# Altium schematic sheet PLD_Flash-Memory.SchDoc: Flash Memory
size A4; SheetTotal: 32
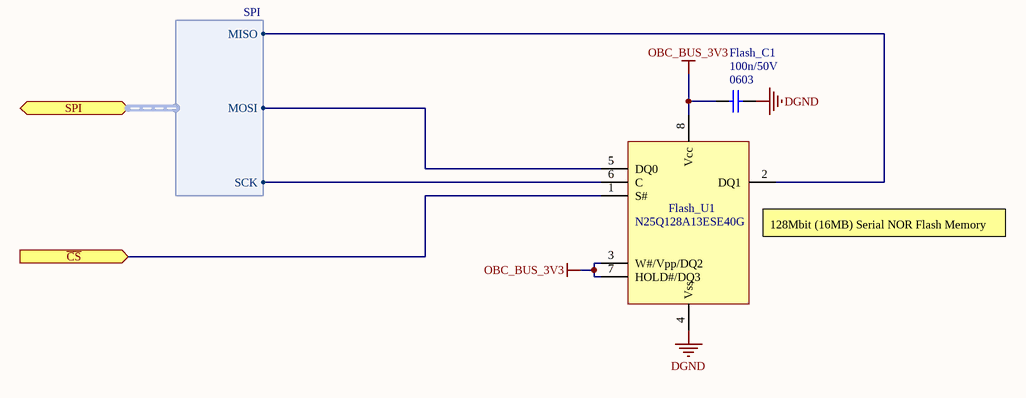
[diagram p0: PLD_Flash-Memory.SchDoc]

## Parts
Flash_C1  Package: 0603  [SMD_Capacitor_0603]  (hidden comment: 100n/50V)
Flash_U1  (no value)  [SOIC-8-W]

## Ports
SPI (harness SPI), ~{CS} (in)

## Harnesses
SPI: MISO, MOSI, SCK

## Nets
DGND: Flash_C1.1 Flash_U1.4(Vss)
OBC_BUS_3V3: Flash_C1.2 Flash_U1.3(W#/Vpp/DQ2) Flash_U1.7(HOLD#/DQ3) Flash_U1.8(Vcc)
~{CS}: Flash_U1.1(S#) ; port ~{CS}
NetFlash_U1_2: Flash_U1.2(DQ1) ; port SPI.MISO
NetFlash_U1_5: Flash_U1.5(DQ0) ; port SPI.MOSI
NetFlash_U1_6: Flash_U1.6(C) ; port SPI.SCK

## Notes on the sheet
- (near Flash_U1) 128Mbit (16MB) Serial NOR Flash Memory
- Title:
- Project:
- Author:
- Model:
- Document Number:
- Checked by:
- Rev:
- Date:
- Approved by:
- Sheet:
- of
- File name:

## Library data of the parts
Flash_C1 = Cer_C0603T104K5RALTU: Ceramic Cap Kemet COTS 100n/50V X7R 0603; Manufacturer: Kemet; ManufacturerPartNumber: C0603T104K5RALTU; Value: 100n/50V
Flash_U1 = N25Q128A13ESE40G: 128Mbit, 3V Serial NOR Flash Memory; Manufacturer: Micron; ManufacturerPartNumber: N25Q128A13ESE40G